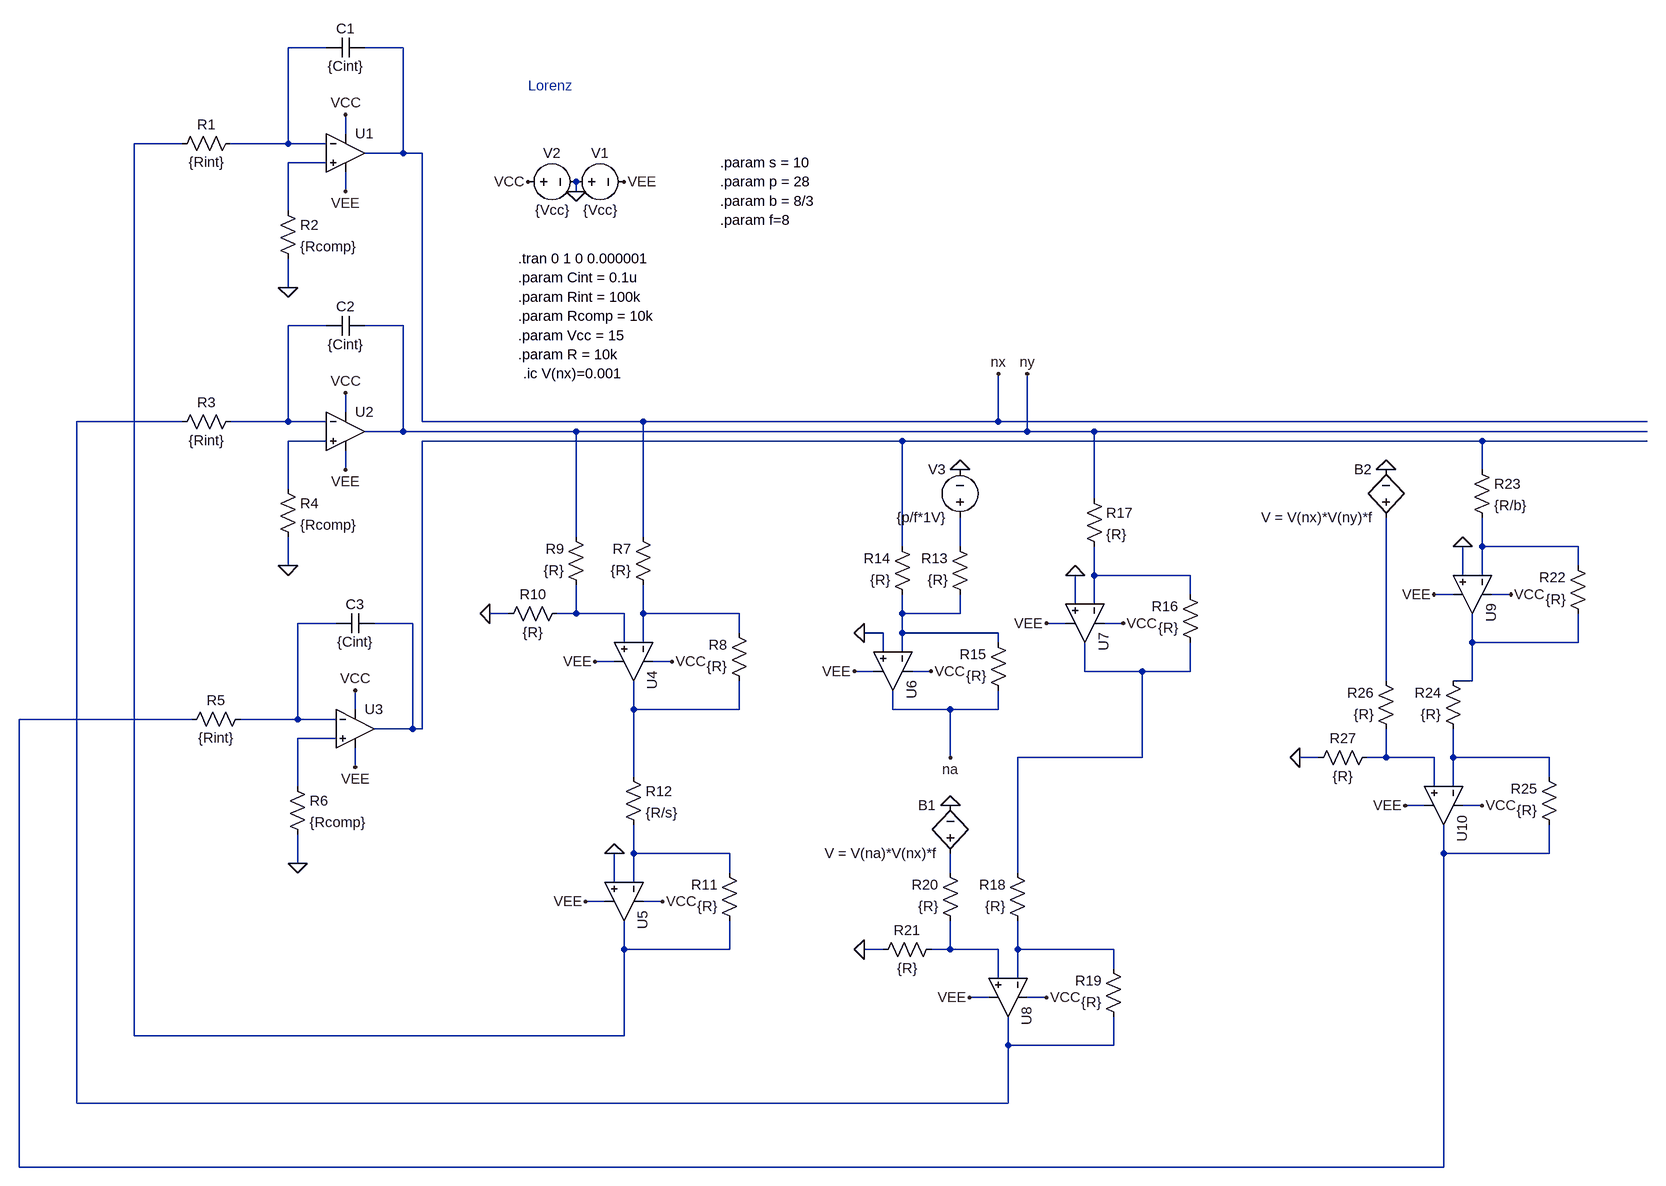
[diagram p0: schematic lorenz.asc]
lorenz.asc, the LTspice schematic file:
Version 4.1
SHEET 1 3172 2036
WIRE 80 -32 16 -32
WIRE 208 -32 144 -32
WIRE 112 112 112 80
WIRE -160 128 -240 128
WIRE 16 128 16 -32
WIRE 16 128 -80 128
WIRE 80 128 16 128
WIRE 208 144 208 -32
WIRE 208 144 144 144
WIRE 240 144 208 144
WIRE 80 160 16 160
WIRE 112 208 112 176
WIRE 496 208 496 192
WIRE 16 240 16 160
WIRE 16 368 16 320
WIRE 80 432 16 432
WIRE 208 432 144 432
WIRE 112 576 112 544
WIRE -160 592 -336 592
WIRE 16 592 16 432
WIRE 16 592 -80 592
WIRE 80 592 16 592
WIRE 240 592 240 144
WIRE 608 592 240 592
WIRE 1200 592 1200 512
WIRE 1200 592 608 592
WIRE 3168 592 1200 592
WIRE 208 608 208 432
WIRE 208 608 144 608
WIRE 496 608 208 608
WIRE 1248 608 1248 512
WIRE 1248 608 496 608
WIRE 1360 608 1248 608
WIRE 3168 608 1360 608
WIRE 80 624 16 624
WIRE 1040 624 240 624
WIRE 2016 624 1040 624
WIRE 3168 624 2016 624
WIRE 112 672 112 640
WIRE 2016 672 2016 624
WIRE 16 704 16 624
WIRE 1360 720 1360 608
WIRE 496 784 496 608
WIRE 608 784 608 592
WIRE 1040 800 1040 624
WIRE 1136 800 1136 752
WIRE 2016 800 2016 752
WIRE 2176 800 2016 800
WIRE 16 832 16 784
WIRE 2176 832 2176 800
WIRE 1360 848 1360 800
WIRE 1520 848 1360 848
WIRE 1984 848 1984 800
WIRE 2016 848 2016 800
WIRE 1520 880 1520 848
WIRE 1968 880 1936 880
WIRE 2064 880 2032 880
WIRE 1328 896 1328 848
WIRE 1360 896 1360 848
WIRE 384 912 352 912
WIRE 496 912 496 864
WIRE 496 912 464 912
WIRE 576 912 496 912
WIRE 608 912 608 864
WIRE 768 912 608 912
WIRE 1040 912 1040 880
WIRE 1136 912 1136 880
WIRE 1136 912 1040 912
WIRE 96 928 32 928
WIRE 224 928 160 928
WIRE 1312 928 1280 928
WIRE 1408 928 1376 928
WIRE 768 944 768 912
WIRE 1008 944 976 944
WIRE 1040 944 1040 912
WIRE 1200 944 1040 944
WIRE 576 960 576 912
WIRE 608 960 608 912
WIRE 1200 960 1200 944
WIRE 2000 960 2000 912
WIRE 2176 960 2176 912
WIRE 2176 960 2000 960
WIRE 1008 976 1008 944
WIRE 1040 976 1040 944
WIRE 560 992 528 992
WIRE 656 992 624 992
WIRE 992 1008 960 1008
WIRE 1088 1008 1056 1008
WIRE 1344 1008 1344 960
WIRE 1440 1008 1344 1008
WIRE 1520 1008 1520 960
WIRE 1520 1008 1440 1008
WIRE 1856 1024 1856 752
WIRE 2000 1024 2000 960
WIRE 2000 1024 1968 1024
WIRE 128 1072 128 1040
WIRE 592 1072 592 1024
WIRE 768 1072 768 1024
WIRE 768 1072 592 1072
WIRE 1024 1072 1024 1040
WIRE 1120 1072 1024 1072
WIRE 1200 1072 1200 1040
WIRE 1200 1072 1120 1072
WIRE -144 1088 -432 1088
WIRE 32 1088 32 928
WIRE 32 1088 -64 1088
WIRE 96 1088 32 1088
WIRE 224 1104 224 928
WIRE 224 1104 160 1104
WIRE 240 1104 240 624
WIRE 240 1104 224 1104
WIRE 96 1120 32 1120
WIRE 1120 1152 1120 1072
WIRE 1440 1152 1440 1008
WIRE 1440 1152 1232 1152
WIRE 1744 1152 1712 1152
WIRE 1856 1152 1856 1104
WIRE 1856 1152 1824 1152
WIRE 1936 1152 1856 1152
WIRE 1968 1152 1968 1104
WIRE 2128 1152 1968 1152
WIRE 128 1168 128 1136
WIRE 592 1184 592 1072
WIRE 2128 1184 2128 1152
WIRE 32 1200 32 1120
WIRE 1936 1200 1936 1152
WIRE 1968 1200 1968 1152
WIRE 1920 1232 1888 1232
WIRE 2016 1232 1984 1232
WIRE 592 1312 592 1264
WIRE 752 1312 592 1312
WIRE 1952 1312 1952 1264
WIRE 2128 1312 2128 1264
WIRE 2128 1312 1952 1312
WIRE 32 1328 32 1280
WIRE 752 1344 752 1312
WIRE 1120 1344 1120 1312
WIRE 1232 1344 1232 1152
WIRE 560 1360 560 1312
WIRE 592 1360 592 1312
WIRE 544 1392 512 1392
WIRE 640 1392 608 1392
WIRE 576 1472 576 1424
WIRE 752 1472 752 1424
WIRE 752 1472 576 1472
WIRE 1008 1472 976 1472
WIRE 1120 1472 1120 1424
WIRE 1120 1472 1088 1472
WIRE 1200 1472 1120 1472
WIRE 1232 1472 1232 1424
WIRE 1392 1472 1232 1472
WIRE 1392 1504 1392 1472
WIRE 1200 1520 1200 1472
WIRE 1232 1520 1232 1472
WIRE 1184 1552 1152 1552
WIRE 1280 1552 1248 1552
WIRE -240 1616 -240 128
WIRE 576 1616 576 1472
WIRE 576 1616 -240 1616
WIRE 1216 1632 1216 1584
WIRE 1392 1632 1392 1584
WIRE 1392 1632 1216 1632
WIRE -336 1728 -336 592
WIRE 1216 1728 1216 1632
WIRE 1216 1728 -336 1728
WIRE -432 1840 -432 1088
WIRE 1952 1840 1952 1312
WIRE 1952 1840 -432 1840
FLAG 496 208 0
FLAG 416 192 VCC
FLAG 576 192 VEE
FLAG 112 80 VCC
FLAG 112 208 VEE
FLAG 16 368 0
FLAG 112 544 VCC
FLAG 112 672 VEE
FLAG 16 832 0
FLAG 128 1040 VCC
FLAG 128 1168 VEE
FLAG 32 1328 0
FLAG 656 992 VCC
FLAG 528 992 VEE
FLAG 352 912 0
FLAG 640 1392 VCC
FLAG 512 1392 VEE
FLAG 560 1312 0
FLAG 1088 1008 VCC
FLAG 960 1008 VEE
FLAG 976 944 0
FLAG 1136 672 0
FLAG 1408 928 VCC
FLAG 1280 928 VEE
FLAG 1328 848 0
FLAG 1120 1152 na
FLAG 1200 512 nx
FLAG 1120 1232 0
FLAG 1280 1552 VCC
FLAG 1152 1552 VEE
FLAG 976 1472 0
FLAG 1248 512 ny
FLAG 2064 880 VCC
FLAG 1936 880 VEE
FLAG 1984 800 0
FLAG 2016 1232 VCC
FLAG 1888 1232 VEE
FLAG 1712 1152 0
FLAG 1856 672 0
SYMBOL OpAmps\\UniversalOpAmp2 112 144 R0
SYMATTR InstName U1
SYMATTR Value2 Avol=1Meg GBW=1Meg Slew=10Meg
SYMBOL res -64 112 R90
WINDOW 0 0 56 VBottom 2
WINDOW 3 32 56 VTop 2
SYMATTR InstName R1
SYMATTR Value {Rint}
SYMBOL voltage 480 192 R270
WINDOW 0 32 56 VTop 2
WINDOW 3 -32 56 VBottom 2
SYMATTR InstName V1
SYMATTR Value {Vcc}
SYMBOL voltage 400 192 R270
WINDOW 0 32 56 VTop 2
WINDOW 3 -32 56 VBottom 2
SYMATTR InstName V2
SYMATTR Value {Vcc}
SYMBOL res 0 224 R0
SYMATTR InstName R2
SYMATTR Value {Rcomp}
SYMBOL cap 144 -48 R90
WINDOW 0 0 32 VBottom 2
WINDOW 3 32 32 VTop 2
SYMATTR InstName C1
SYMATTR Value {Cint}
SYMBOL OpAmps\\UniversalOpAmp2 112 608 R0
SYMATTR InstName U2
SYMATTR Value2 Avol=1Meg GBW=1Meg Slew=10Meg
SYMBOL res -64 576 R90
WINDOW 0 0 56 VBottom 2
WINDOW 3 32 56 VTop 2
SYMATTR InstName R3
SYMATTR Value {Rint}
SYMBOL res 0 688 R0
SYMATTR InstName R4
SYMATTR Value {Rcomp}
SYMBOL cap 144 416 R90
WINDOW 0 0 32 VBottom 2
WINDOW 3 32 32 VTop 2
SYMATTR InstName C2
SYMATTR Value {Cint}
SYMBOL OpAmps\\UniversalOpAmp2 128 1104 R0
SYMATTR InstName U3
SYMATTR Value2 Avol=1Meg GBW=1Meg Slew=10Meg
SYMBOL res -48 1072 R90
WINDOW 0 0 56 VBottom 2
WINDOW 3 32 56 VTop 2
SYMATTR InstName R5
SYMATTR Value {Rint}
SYMBOL res 16 1184 R0
SYMATTR InstName R6
SYMATTR Value {Rcomp}
SYMBOL cap 160 912 R90
WINDOW 0 0 32 VBottom 2
WINDOW 3 32 32 VTop 2
SYMATTR InstName C3
SYMATTR Value {Cint}
SYMBOL OpAmps\\UniversalOpAmp2 592 992 R90
SYMATTR InstName U4
SYMATTR Value2 Avol=1Meg GBW=1Meg Slew=10Meg
SYMBOL res 624 880 R180
WINDOW 0 36 76 Left 2
WINDOW 3 36 40 Left 2
SYMATTR InstName R7
SYMATTR Value {R}
SYMBOL res 784 1040 R180
WINDOW 0 36 76 Left 2
WINDOW 3 36 40 Left 2
SYMATTR InstName R8
SYMATTR Value {R}
SYMBOL res 512 880 R180
WINDOW 0 36 76 Left 2
WINDOW 3 36 40 Left 2
SYMATTR InstName R9
SYMATTR Value {R}
SYMBOL res 368 928 R270
WINDOW 0 32 56 VTop 2
WINDOW 3 0 56 VBottom 2
SYMATTR InstName R10
SYMATTR Value {R}
SYMBOL OpAmps\\UniversalOpAmp2 576 1392 R90
SYMATTR InstName U5
SYMATTR Value2 Avol=1Meg GBW=1Meg Slew=10Meg
SYMBOL res 768 1440 R180
WINDOW 0 36 76 Left 2
WINDOW 3 36 40 Left 2
SYMATTR InstName R11
SYMATTR Value {R}
SYMBOL res 576 1168 R0
SYMATTR InstName R12
SYMATTR Value {R/s}
SYMBOL res 1152 896 R180
WINDOW 0 36 76 Left 2
WINDOW 3 36 40 Left 2
SYMATTR InstName R13
SYMATTR Value {R}
SYMBOL res 1056 896 R180
WINDOW 0 36 76 Left 2
WINDOW 3 36 40 Left 2
SYMATTR InstName R14
SYMATTR Value {R}
SYMBOL OpAmps\\UniversalOpAmp2 1024 1008 R90
SYMATTR InstName U6
SYMATTR Value2 Avol=1Meg GBW=1Meg Slew=10Meg
SYMBOL res 1216 1056 R180
WINDOW 0 36 76 Left 2
WINDOW 3 36 40 Left 2
SYMATTR InstName R15
SYMATTR Value {R}
SYMBOL voltage 1136 768 R180
WINDOW 0 24 96 Left 2
WINDOW 3 24 16 Left 2
SYMATTR InstName V3
SYMATTR Value {p/f*1V}
SYMBOL OpAmps\\UniversalOpAmp2 1344 928 R90
SYMATTR InstName U7
SYMATTR Value2 Avol=1Meg GBW=1Meg Slew=10Meg
SYMBOL res 1536 976 R180
WINDOW 0 36 76 Left 2
WINDOW 3 36 40 Left 2
SYMATTR InstName R16
SYMATTR Value {R}
SYMBOL res 1344 704 R0
SYMATTR InstName R17
SYMATTR Value {R}
SYMBOL bv 1120 1328 R180
WINDOW 0 24 96 Left 2
WINDOW 3 24 16 Left 2
SYMATTR InstName B1
SYMATTR Value V = V(na)*V(nx)*f
SYMBOL OpAmps\\UniversalOpAmp2 1216 1552 R90
SYMATTR InstName U8
SYMATTR Value2 Avol=1Meg GBW=1Meg Slew=10Meg
SYMBOL res 1248 1440 R180
WINDOW 0 36 76 Left 2
WINDOW 3 36 40 Left 2
SYMATTR InstName R18
SYMATTR Value {R}
SYMBOL res 1408 1600 R180
WINDOW 0 36 76 Left 2
WINDOW 3 36 40 Left 2
SYMATTR InstName R19
SYMATTR Value {R}
SYMBOL res 1136 1440 R180
WINDOW 0 36 76 Left 2
WINDOW 3 36 40 Left 2
SYMATTR InstName R20
SYMATTR Value {R}
SYMBOL res 992 1488 R270
WINDOW 0 32 56 VTop 2
WINDOW 3 0 56 VBottom 2
SYMATTR InstName R21
SYMATTR Value {R}
SYMBOL bv 1856 768 R180
WINDOW 0 24 96 Left 2
WINDOW 3 24 16 Left 2
SYMATTR InstName B2
SYMATTR Value V = V(nx)*V(ny)*f
SYMBOL OpAmps\\UniversalOpAmp2 2000 880 R90
SYMATTR InstName U9
SYMATTR Value2 Avol=1Meg GBW=1Meg Slew=10Meg
SYMBOL res 2192 928 R180
WINDOW 0 36 76 Left 2
WINDOW 3 36 40 Left 2
SYMATTR InstName R22
SYMATTR Value {R}
SYMBOL res 2000 656 R0
SYMATTR InstName R23
SYMATTR Value {R/b}
SYMBOL OpAmps\\UniversalOpAmp2 1952 1232 R90
SYMATTR InstName U10
SYMATTR Value2 Avol=1Meg GBW=1Meg Slew=10Meg
SYMBOL res 1984 1120 R180
WINDOW 0 36 76 Left 2
WINDOW 3 36 40 Left 2
SYMATTR InstName R24
SYMATTR Value {R}
SYMBOL res 2144 1280 R180
WINDOW 0 36 76 Left 2
WINDOW 3 36 40 Left 2
SYMATTR InstName R25
SYMATTR Value {R}
SYMBOL res 1872 1120 R180
WINDOW 0 36 76 Left 2
WINDOW 3 36 40 Left 2
SYMATTR InstName R26
SYMATTR Value {R}
SYMBOL res 1728 1168 R270
WINDOW 0 32 56 VTop 2
WINDOW 3 0 56 VBottom 2
SYMATTR InstName R27
SYMATTR Value {R}
TEXT 400 352 Left 2 !.param Cint = 0.1u
TEXT 400 416 Left 2 !.param Rcomp = 10k
TEXT 400 384 Left 2 !.param Rint = 100k
TEXT 400 448 Left 2 !.param Vcc = 15
TEXT 400 320 Left 2 !.tran 0 1 0 0.000001
TEXT 400 480 Left 2 !.param R = 10k
TEXT 736 160 Left 2 !.param s = 10
TEXT 736 192 Left 2 !.param p = 28
TEXT 736 224 Left 2 !.param b = 8/3
TEXT 408 512 Left 2 !.ic V(nx)=0.001
TEXT 736 256 Left 2 !.param f=8
TEXT 416 32 Left 2 ;Lorenz

The netlist it stands for:
* lorenz.asc
X§U1 N003 N001 VCC VEE nx level2 Avol=1Meg GBW=1Meg Slew=10Meg Ilimit=25m Rail=0 Vos=0 En=0 Enk=0 In=0 Ink=0 Rin=500Meg  ; pins In+ In- V+ V- OUT
R1 N001 N002 {Rint}
V1 0 VEE {Vcc}
V2 VCC 0 {Vcc}
R2 N003 0 {Rcomp}
C1 nx N001 {Cint}
X§U2 N006 N004 VCC VEE ny level2 Avol=1Meg GBW=1Meg Slew=10Meg Ilimit=25m Rail=0 Vos=0 En=0 Enk=0 In=0 Ink=0 Rin=500Meg  ; pins In+ In- V+ V- OUT
R3 N004 N005 {Rint}
R4 N006 0 {Rcomp}
C2 ny N004 {Cint}
X§U3 N020 N014 VCC VEE N007 level2 Avol=1Meg GBW=1Meg Slew=10Meg Ilimit=25m Rail=0 Vos=0 En=0 Enk=0 In=0 Ink=0 Rin=500Meg  ; pins In+ In- V+ V- OUT
R5 N014 N019 {Rint}
R6 N020 0 {Rcomp}
C3 N007 N014 {Cint}
X§U4 N011 N012 VCC VEE N018 level2 Avol=1Meg GBW=1Meg Slew=10Meg Ilimit=25m Rail=0 Vos=0 En=0 Enk=0 In=0 Ink=0 Rin=500Meg  ; pins In+ In- V+ V- OUT
R7 N012 nx {R}
R8 N018 N012 {R}
R9 N011 ny {R}
R10 0 N011 {R}
X§U5 0 N023 VCC VEE N002 level2 Avol=1Meg GBW=1Meg Slew=10Meg Ilimit=25m Rail=0 Vos=0 En=0 Enk=0 In=0 Ink=0 Rin=500Meg  ; pins In+ In- V+ V- OUT
R11 N002 N023 {R}
R12 N018 N023 {R/s}
R13 N013 N008 {R}
R14 N013 N007 {R}
X§U6 0 N013 VCC VEE na level2 Avol=1Meg GBW=1Meg Slew=10Meg Ilimit=25m Rail=0 Vos=0 En=0 Enk=0 In=0 Ink=0 Rin=500Meg  ; pins In+ In- V+ V- OUT
R15 na N013 {R}
V3 N008 0 {p/f*1V}
X§U7 0 N010 VCC VEE N016 level2 Avol=1Meg GBW=1Meg Slew=10Meg Ilimit=25m Rail=0 Vos=0 En=0 Enk=0 In=0 Ink=0 Rin=500Meg  ; pins In+ In- V+ V- OUT
R16 N016 N010 {R}
R17 ny N010 {R}
B1 N024 0 V = V(na)*V(nx)*f
X§U8 N025 N026 VCC VEE N005 level2 Avol=1Meg GBW=1Meg Slew=10Meg Ilimit=25m Rail=0 Vos=0 En=0 Enk=0 In=0 Ink=0 Rin=500Meg  ; pins In+ In- V+ V- OUT
R18 N026 N016 {R}
R19 N005 N026 {R}
R20 N025 N024 {R}
R21 0 N025 {R}
B2 N017 0 V = V(nx)*V(ny)*f
X§U9 0 N009 VCC VEE N015 level2 Avol=1Meg GBW=1Meg Slew=10Meg Ilimit=25m Rail=0 Vos=0 En=0 Enk=0 In=0 Ink=0 Rin=500Meg  ; pins In+ In- V+ V- OUT
R22 N015 N009 {R}
R23 N007 N009 {R/b}
X§U10 N021 N022 VCC VEE N019 level2 Avol=1Meg GBW=1Meg Slew=10Meg Ilimit=25m Rail=0 Vos=0 En=0 Enk=0 In=0 Ink=0 Rin=500Meg  ; pins In+ In- V+ V- OUT
R24 N022 N015 {R}
R25 N019 N022 {R}
R26 N021 N017 {R}
R27 0 N021 {R}
.param Cint = 0.1u
.param Rcomp = 10k
.param Rint = 100k
.param Vcc = 15
.tran 0 1 0 0.000001
.param R = 10k
.param s = 10
.param p = 28
.param b = 8/3
.ic V(nx)=0.001
.param f=8
* Lorenz
.lib UniversalOpAmp2.lib
.backanno
.end